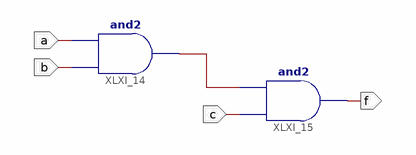
[diagram p0: schematic sheet 1]
// Xilinx ISE schematic simple.sch (spartan3e) as structural Verilog: 2 symbols, 4 ports
module simple (
  input  a,
  input  b,
  input  c,
  output f
);

  wire XLXN_11;

  and XLXI_14 (XLXN_11, b, a);
  and XLXI_15 (f, c, XLXN_11);
endmodule
